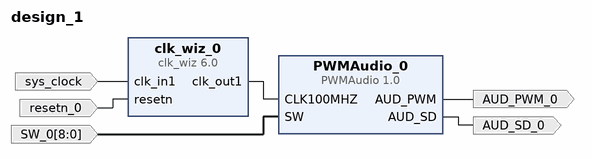
[diagram p0: block diagram of the top level]
# Vivado block design design_1, xc7a100tcsg324-1, Vivado 2020.1
create_bd_design design_1

create_bd_port -dir I -type clk sys_clock
set_property -dict {CONFIG.FREQ_HZ 100000000 CONFIG.PHASE 0.000} [get_bd_ports sys_clock]
create_bd_port -dir O AUD_PWM_0
create_bd_port -dir O AUD_SD_0
create_bd_port -dir I -from 8 -to 0 SW_0
create_bd_port -dir I -type rst resetn_0

create_bd_cell -type ip -vlnv Delta_securities:user:PWMAudio:1.0 PWMAudio_0
create_bd_cell -type ip -vlnv xilinx.com:ip:clk_wiz:6.0 clk_wiz_0
set_property -dict [list \
  CONFIG.CLK_IN1_BOARD_INTERFACE sys_clock \
  CONFIG.RESET_PORT resetn \
  CONFIG.RESET_TYPE ACTIVE_LOW \
  CONFIG.USE_BOARD_FLOW true \
] [get_bd_cells clk_wiz_0]

# ---- connections ----

connect_bd_net [get_bd_ports sys_clock] [get_bd_pins clk_wiz_0/clk_in1]
connect_bd_net [get_bd_pins PWMAudio_0/AUD_PWM] [get_bd_ports AUD_PWM_0]
connect_bd_net [get_bd_pins PWMAudio_0/AUD_SD] [get_bd_ports AUD_SD_0]
connect_bd_net -net SW_0_1 [get_bd_ports SW_0] [get_bd_pins PWMAudio_0/SW]
connect_bd_net [get_bd_pins clk_wiz_0/clk_out1] [get_bd_pins PWMAudio_0/CLK100MHZ]
connect_bd_net -net resetn_0_1 [get_bd_ports resetn_0] [get_bd_pins clk_wiz_0/resetn]

validate_bd_design
save_bd_design
